# EAGLE schematic mb (EAGLE 7.2.0)
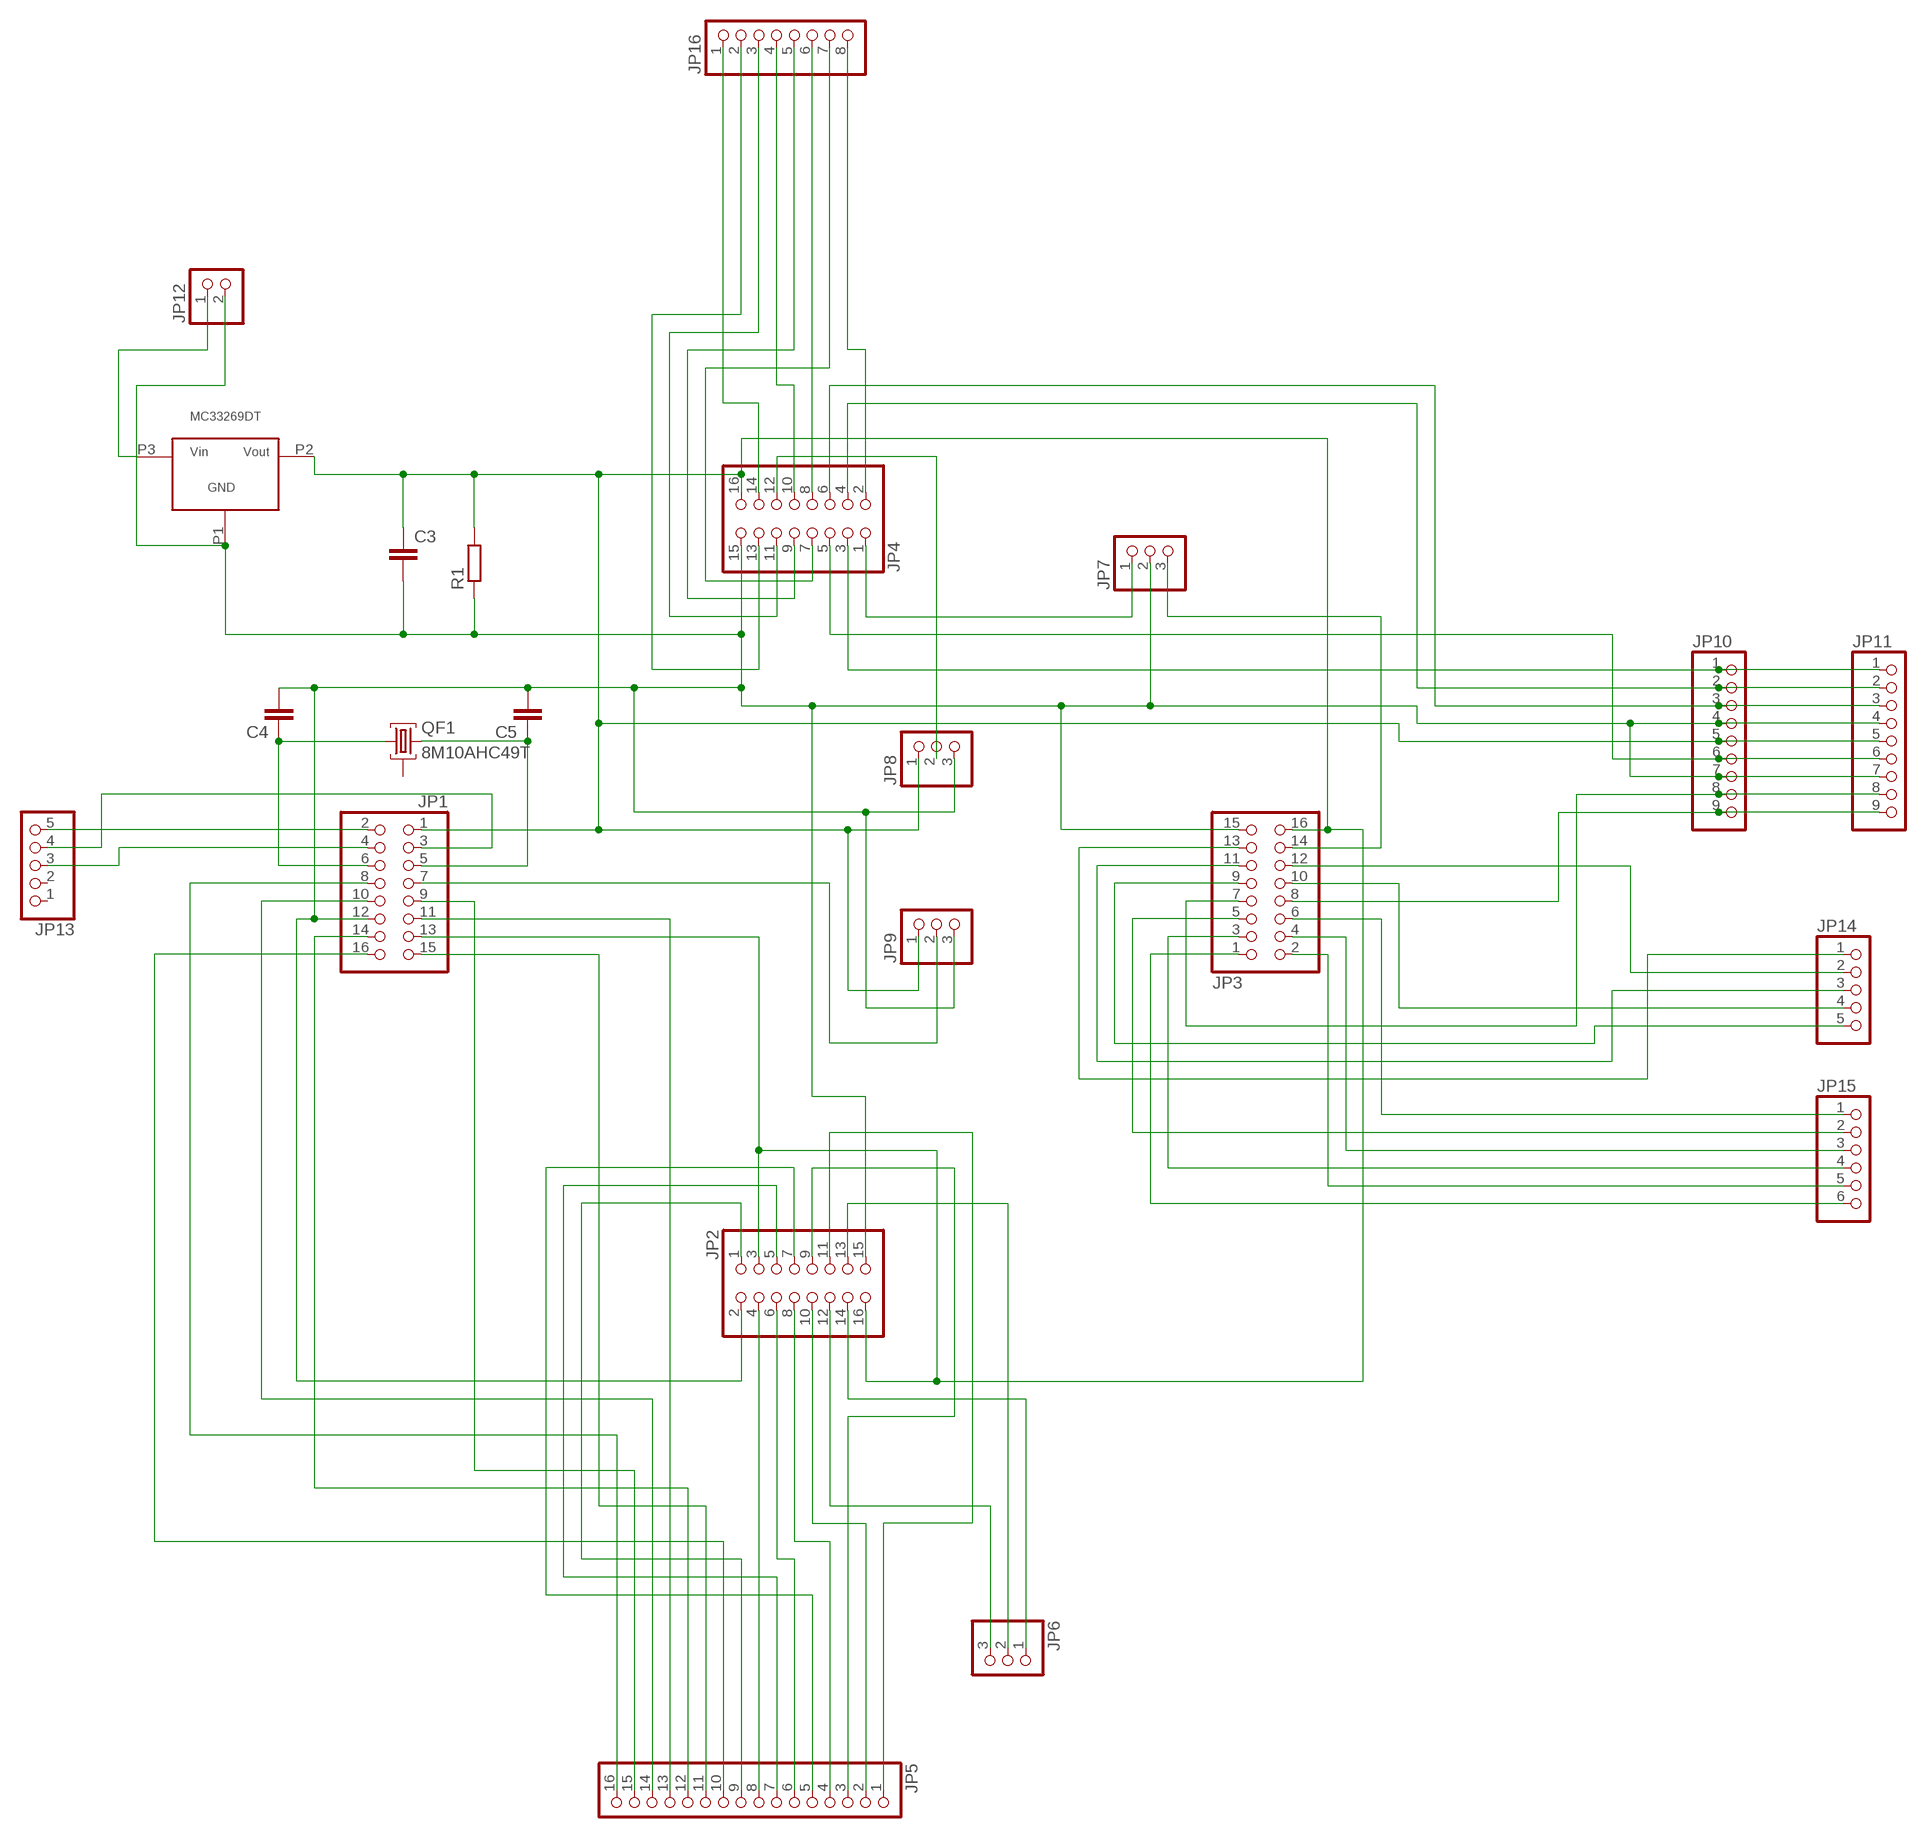
[diagram p0: schematic, sheet 1]

## Parts
C3  C5/2.5  [C5B2.5]
C4  C-EUC1206  [C1206]
C5  C-EUC1206  [C1206]
JP1  PINHD-2X8  [2X08]
JP2  PINHD-2X8  [2X08]
JP3  PINHD-2X8  [2X08]
JP4  PINHD-2X8  [2X08]
JP5  PINHD-1X16  [1X16]
JP6  PINHD-1X3  [1X03]
JP7  PINHD-1X3  [1X03]
JP8  PINHD-1X3  [1X03]
JP9  PINHD-1X3  [1X03]
JP10  PINHD-1X9  [1X09]
JP11  PINHD-1X9  [1X09]
JP12  PINHD-1X2  [1X02]
JP13  PINHD-1X5  [1X05]
JP14  PINHD-1X5  [1X05]
JP15  PINHD-1X6  [1X06]
JP16  PINHD-1X8  [1X08]
QF1  8M10AHC49T  [HC49U]
R1  R-EU_M1206  [M1206]
U$1  MC33269DT  [MC33269DT]

## Nets
N$1: C3.2 C4.2 C5.2 JP1.12 JP2.2 JP2.15 JP3.15 JP4.15 JP7.2 JP8.3 JP9.3 JP10.4 JP10.7 JP11.4 JP11.7 JP12.2 R1.1 U$1.P1(GND)
N$2: C3.1 JP1.1 JP1.13 JP2.3 JP2.16 JP3.16 JP4.16 JP8.1 JP9.1 JP10.5 JP11.5 R1.2 U$1.P2(VOUT)
N$4: C5.1 JP1.5 QF1.3
N$5: JP4.1 JP7.1
N$6: JP1.8 JP5.16
N$7: JP1.9 JP5.15
N$8: JP1.10 JP5.14
N$9: JP1.11 JP5.13
N$10: JP1.14 JP5.12
N$11: JP1.15 JP5.11
N$12: JP1.16 JP5.10
N$13: JP2.1 JP5.9
N$14: JP2.4 JP5.8
N$15: JP2.5 JP5.7
N$16: JP2.6 JP5.6
N$17: JP2.7 JP5.5
N$18: JP2.8 JP5.4
N$19: JP2.9 JP5.3
N$20: JP2.10 JP5.2
N$21: JP2.11 JP5.1
N$22: JP2.12 JP6.3
N$23: JP2.13 JP6.2
N$24: JP2.14 JP6.1
N$25: JP3.14 JP7.3
N$26: JP4.3 JP10.1 JP11.1
N$27: JP4.12 JP8.2
N$28: JP1.7 JP9.2
N$29: JP4.4 JP10.2 JP11.2
N$30: JP4.6 JP10.3 JP11.3
N$31: JP4.5 JP10.6 JP11.6
N$32: JP3.7 JP10.8 JP11.8
N$33: JP3.8 JP10.9 JP11.9
N$34: JP12.1 U$1.P3(VIN)
N$36: JP1.2 JP13.5
N$37: JP1.3 JP13.4
N$38: JP1.4 JP13.3
N$39: C4.1 JP1.6 QF1.1
N$41: JP3.1 JP15.6
N$42: JP3.2 JP15.5
N$43: JP3.3 JP15.4
N$44: JP3.4 JP15.3
N$45: JP3.5 JP15.2
N$46: JP3.6 JP15.1
N$47: JP3.9 JP14.5
N$48: JP3.10 JP14.4
N$49: JP3.11 JP14.3
N$50: JP3.12 JP14.2
N$51: JP3.13 JP14.1
N$52: JP4.2 JP16.8
N$53: JP4.7 JP16.7
N$54: JP4.8 JP16.6
N$55: JP4.9 JP16.5
N$56: JP4.10 JP16.4
N$57: JP4.11 JP16.3
N$58: JP4.13 JP16.2
N$59: JP4.14 JP16.1
Unconnected: JP13.1 JP13.2 QF1.2

## Library data of the parts
C3 = capacitor-wima:C: CAPACITOR naming: grid - package width
C4 C5 = resistor:C-EU: CAPACITOR, European symbol
JP1-JP4 = pinhead:PINHD-2X8: PIN HEADER
JP5 = pinhead:PINHD-1X16: PIN HEADER
JP6-JP9 = pinhead:PINHD-1X3: PIN HEADER
JP10 JP11 = pinhead:PINHD-1X9: PIN HEADER
JP12 = pinhead:PINHD-1X2: PIN HEADER
JP13 JP14 = pinhead:PINHD-1X5: PIN HEADER
JP15 = pinhead:PINHD-1X6: PIN HEADER
JP16 = pinhead:PINHD-1X8: PIN HEADER
QF1 = crystal:8M10AHC49T: Monolithic Crystal Filters Source: www.vanlong.com; OC_FARNELL: unknown; OC_NEWARK: unknown
R1 = rcl:R-EU_: RESISTOR, European symbol
U$1 = mc33269dt:MC33269DT